# Altium schematic sheet memorychip_schematic.SchDoc
size A4
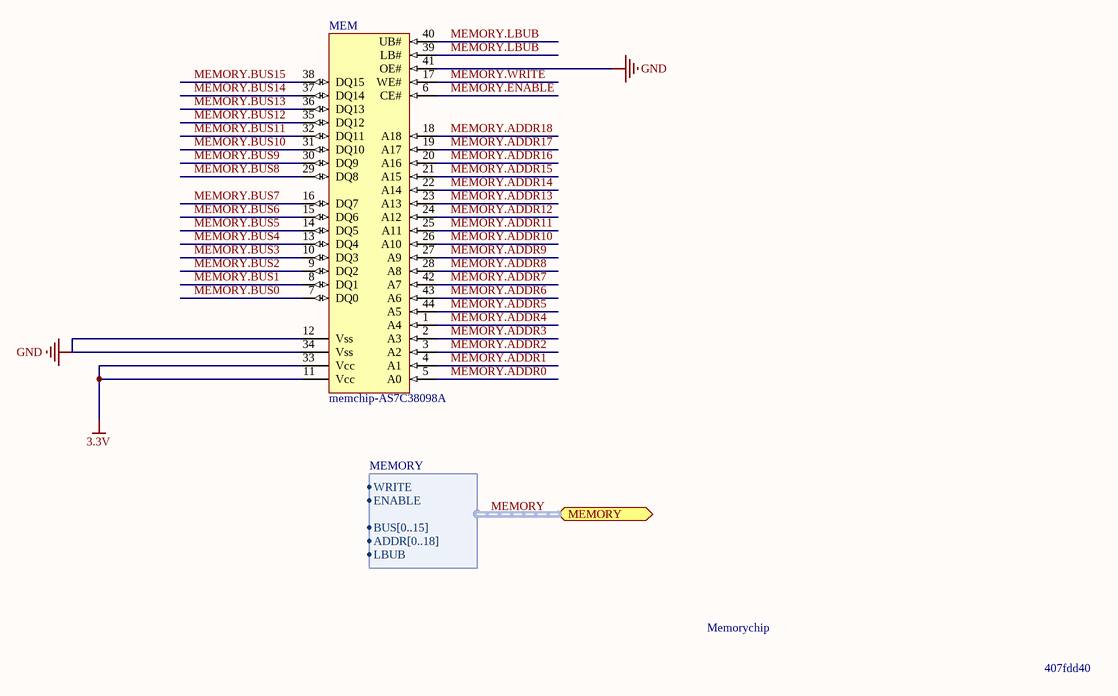
[diagram p0: memorychip_schematic.SchDoc]

## Parts
MEM  memchip-AS7C38098A  [AS7C38098A-10TIN]

## Ports
MEMORY (harness MEMORY)

## Harnesses
MEMORY: WRITE, ENABLE, ADDR[0..18], BUS[0..15], LBUB

## Nets
3.3V: MEM.11(Vcc) MEM.33(Vcc)
GND: MEM.12(Vss) MEM.34(Vss) MEM.41(OE#)
MEMORY.ADDR0: MEM.5(A0)
MEMORY.ADDR1: MEM.4(A1)
MEMORY.ADDR2: MEM.3(A2)
MEMORY.ADDR3: MEM.2(A3)
MEMORY.ADDR4: MEM.1(A4)
MEMORY.ADDR5: MEM.44(A5)
MEMORY.ADDR6: MEM.43(A6)
MEMORY.ADDR7: MEM.42(A7)
MEMORY.ADDR8: MEM.28(A8)
MEMORY.ADDR9: MEM.27(A9)
MEMORY.ADDR10: MEM.26(A10)
MEMORY.ADDR11: MEM.25(A11)
MEMORY.ADDR12: MEM.24(A12)
MEMORY.ADDR13: MEM.23(A13)
MEMORY.ADDR14: MEM.22(A14)
MEMORY.ADDR15: MEM.21(A15)
MEMORY.ADDR16: MEM.20(A16)
MEMORY.ADDR17: MEM.19(A17)
MEMORY.ADDR18: MEM.18(A18)
MEMORY.BUS0: MEM.7(DQ0)
MEMORY.BUS1: MEM.8(DQ1)
MEMORY.BUS2: MEM.9(DQ2)
MEMORY.BUS3: MEM.10(DQ3)
MEMORY.BUS4: MEM.13(DQ4)
MEMORY.BUS5: MEM.14(DQ5)
MEMORY.BUS6: MEM.15(DQ6)
MEMORY.BUS7: MEM.16(DQ7)
MEMORY.BUS8: MEM.29(DQ8)
MEMORY.BUS9: MEM.30(DQ9)
MEMORY.BUS10: MEM.31(DQ10)
MEMORY.BUS11: MEM.32(DQ11)
MEMORY.BUS12: MEM.35(DQ12)
MEMORY.BUS13: MEM.36(DQ13)
MEMORY.BUS14: MEM.37(DQ14)
MEMORY.BUS15: MEM.38(DQ15)
MEMORY.ENABLE: MEM.6(CE#)
MEMORY.LBUB: MEM.39(LB#) MEM.40(UB#)
MEMORY.WRITE: MEM.17(WE#)

## Buses and harness runs
harness MEMORY = port MEMORY

## Notes on the sheet
- Memorychip
- 407fdd40